# EAGLE design charlie_spire_2 (EAGLE 9.4.0)
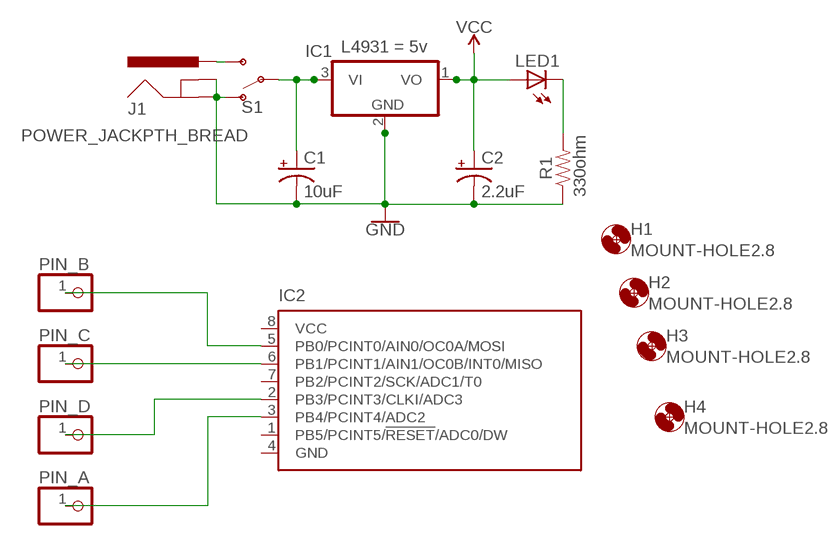
[diagram p0: schematic, sheet 1]

## Parts
C1  10uF  10UF-POLAR-RADIAL-2.5MM-25V-20%  [CPOL-RADIAL-2.5MM-5MM]
C2  2.2uF  10UF-POLAR-RADIAL-2.5MM-25V-20%  [CPOL-RADIAL-2.5MM-5MM]
H1  MOUNT-HOLE2.8  [2,8]
H2  MOUNT-HOLE2.8  [2,8]
H3  MOUNT-HOLE2.8  [2,8]
H4  MOUNT-HOLE2.8  [2,8]
IC1  78L05Z  [TO92]
IC2  TINY13V-10PU  [DIL08]
J1  POWER_JACKPTH_BREAD  [POWER_JACK_PTH_BREAD]
LED1  LED3MM  [LED3MM]
PIN_A  PINHD-1X1  [1X01]
PIN_B  PINHD-1X1  [1X01]
PIN_C  PINHD-1X1  [1X01]
PIN_D  PINHD-1X1  [1X01]
R1  330ohm  RESISTORAXIAL-0.3  [AXIAL-0.3]
S1  SWITCH-SPDT-PTH-11.6X4.0MM  [SWITCH_SPDT_PTH_11.6X4.0MM]

## Nets
GND: C1.2(-) C2.2(-) IC1.2(GND) J1.GND J1.GNDBREAK R1.P$1 S1.1(O)
N$1 [VCC]: J1.PWR S1.3(S)
N$2 [VCC]: C1.1(+) IC1.3(VI) S1.2(P)
N$3: IC2.3(PB4/PCINT4/ADC2) PIN_A.1
N$4: LED1.K(C) R1.P$2
N$5: IC2.5(PB0/PCINT0/AIN0/OC0A/MOSI) PIN_B.1
N$6: IC2.6(PB1/PCINT1/AIN1/OC0B/INT0/MISO) PIN_C.1
N$7: IC2.2(PB3/PCINT3/CLKI/ADC3) PIN_D.1
VCC: C2.1(+) IC1.1(VO) LED1.A
Unconnected: IC2.1(PB5/PCINT5/!RESET!/ADC0/DW) IC2.7(PB2/PCINT2/SCK/ADC1/T0)

## Power pins joined to a net without a drawn wire
GND: IC2.4(GND)
VCC: IC2.8(VCC)

## Library data of the parts
C1 = SparkFun-Capacitors:10UF-POLAR: 10.0µF polarized capacitors A capacitor is a passive two-terminal electrical component used to store electrical energy temporarily in an electric field.; PROD_ID: CAP-08440
C2 = SparkFun-Capacitors:10UF-POLAR: 10.0µF polarized capacitors A capacitor is a passive two-terminal electrical component used to store electrical energy temporarily in an electric field.; PROD_ID: CAP-08440; VALUE: 10uF
H1-H4 = holes:MOUNT-HOLE: MOUNTING HOLE with drill center marker
IC1 = adafruit:78*: Positive VOLTAGE REGULATOR Added bigger pads to the TO-92 package; L4931: 5v
IC2 = atmel:TINY13: 8-bit AVR Microcontroller with 1K Bytes In-System Programmable Flash Source: http://www.atmel.com/dyn/resources/prod_documents/2535S.pdf; MPN: ATTINY45; OC_FARNELL: 9171576; OC_NEWARK: 96K6523
J1 = SparkFun-Connectors:POWER_JACK: Power Jack Connector This is the standard 5.5mm barrel jack for power. The PTH is the most common, proven, reliable, footprint. The Slot footprint only works if the mill layer is transmitted to the PCB fab house so be warned. Here are the connectors we sell at SparkFun: DC Barrel Power Jack/Connector <https://www.sparkfun.com/products/119> (PRT-00119) DC Barrel Power Jack/Connector (SMD) <https://www.sparkfun.com/products/12748> (PRT-12748) DC Barrel Jack Adapter - Breadboard Compatible <https://www.sparkfun.com/products/10811> (PRT-10811) It is used on this SparkFun product (and many, many others): SparkFun RedBoard - Programmed with Arduino <https://www.sparkfun.com/products/12757> (DEV-12757) Also, if you need a mating power supply or connector, please check these out: Wall Adapter Power Supply - 9VDC 650mA <https://www.sparkfun.com/products/298> (TOL-00298) DC Barrel Jack Adapter - Male <https://www.sparkfun.com/products/10287> (PRT-10287); PROD_ID: PRT-10811
LED1 = adafruit:LED: LED OSRAM: - CHIPLED LG R971, LG N971, LY N971, LG Q971, LY Q971, LO R971, LY R971 LH N974, LH R974 LS Q976, LO Q976, LY Q976 LO Q996 - Hyper CHIPLED LW Q18S LB Q993, LB Q99A, LB R99A - SideLED LS A670, LO A670, LY A670, LG A670, LP A670 LB A673, LV A673, LT A673, LW A673 LH A674 LY A675 LS A676, LA A676, LO A676, LY A676, LW A676 LS A679, LY A679, LG A679 - Hyper Micro SIDELED® LS Y876, LA Y876, LO Y876, LY Y876 LT Y87S - SmartLED LW L88C, LW L88S LB L89C, LB L89S, LG L890 LS L89K, LO L89K, LY L89K LS L896, LA L896, LO L896, LY L896 - TOPLED LS T670, LO T670, LY T670, LG T670, LP T670 LSG T670, LSP T670, LSY T670, LOP T670, LYG T670 LG T671, LOG T671, LSG T671 LB T673, LV T673, LT T673, LW T673 LH T674 LS T676, LA T676, LO T676, LY T676, LB T676, LH T676, LSB T676, LW T676 LB T67C, LV T67C, LT T67C, LS T67K, LO T67K, LY T67K, LW E67C LS E67B, LA E67B, LO E67B, LY E67B, LB E67C, LV E67C, LT E67C LW T67C LS T679, LY T679, LG T679 LS T770, LO T770, LY T770, LG T770, LP T770 LB T773, LV T773, LT T773, LW T773 LH T774 LS E675, LA E675, LY E675, LS T675 LS T776, LA T776, LO T776, LY T776, LB T776 LHGB T686 LT T68C, LB T68C - Hyper Mini TOPLED® LB M676 - Mini TOPLED Santana® LG M470 LS M47K, LO M47K, LY M47K Source: http://www.osram.convergy.de/
PIN_A PIN_B PIN_C PIN_D = adafruit:PINHD-1X1: Pin header 1x1 for 0.1" spacing With round pins
R1 = SparkFun-Resistors:RESISTOR: Generic Resistor Package
S1 = SparkFun-Switches:SWITCH-SPDT: Single Pole, Double Throw (SPDT) Switch Single-pole, double-throw (SPDT) switch. Variant Overview SMD-AYZ0202 Surface Mount DPDT Switch <https://www.sparkfun.com/products/597> (COM-00597) Used on e.g. LilyPad Arduino USB - ATmega32U4 Board <https://www.sparkfun.com/products/12049> PTH-11.6X4.0MM SPDT Mini Power Switch <https://www.sparkfun.com/products/102> (COM-00102) Used on e.g. SparkFun Simon Says - Through-Hole Soldering Kit <https://www.sparkfun.com/products/10547> (KIT-10547) PTH-11.6X4.0MM-KIT KIT version of SPDT Mini Power Switch - Simplifies soldering by removing tStop of switch pins - only one side can be soldered. PTH-11.6X4.0MM-LOCK LOCK version of SPDT Mini Power Switch - Offset pins hold switch in place for easier soldering. SMD-RIGHT-ANGLE Surface Mount Right Angle Switch <https://www.sparkfun.com/products/10860> (COM-10860) Used on e.g. SparkFun ESP8266 Thing <https://www.sparkfun.com/products/13231>; PROD_ID: SWCH-08261; SF_SKU: COM-00102

## Net classes
0 default: width 0.254 mm, clearance 0.508 mm
1 VCC: width 0.508 mm, clearance 0.508 mm
2 GND: clearance 0.508 mm

## Board
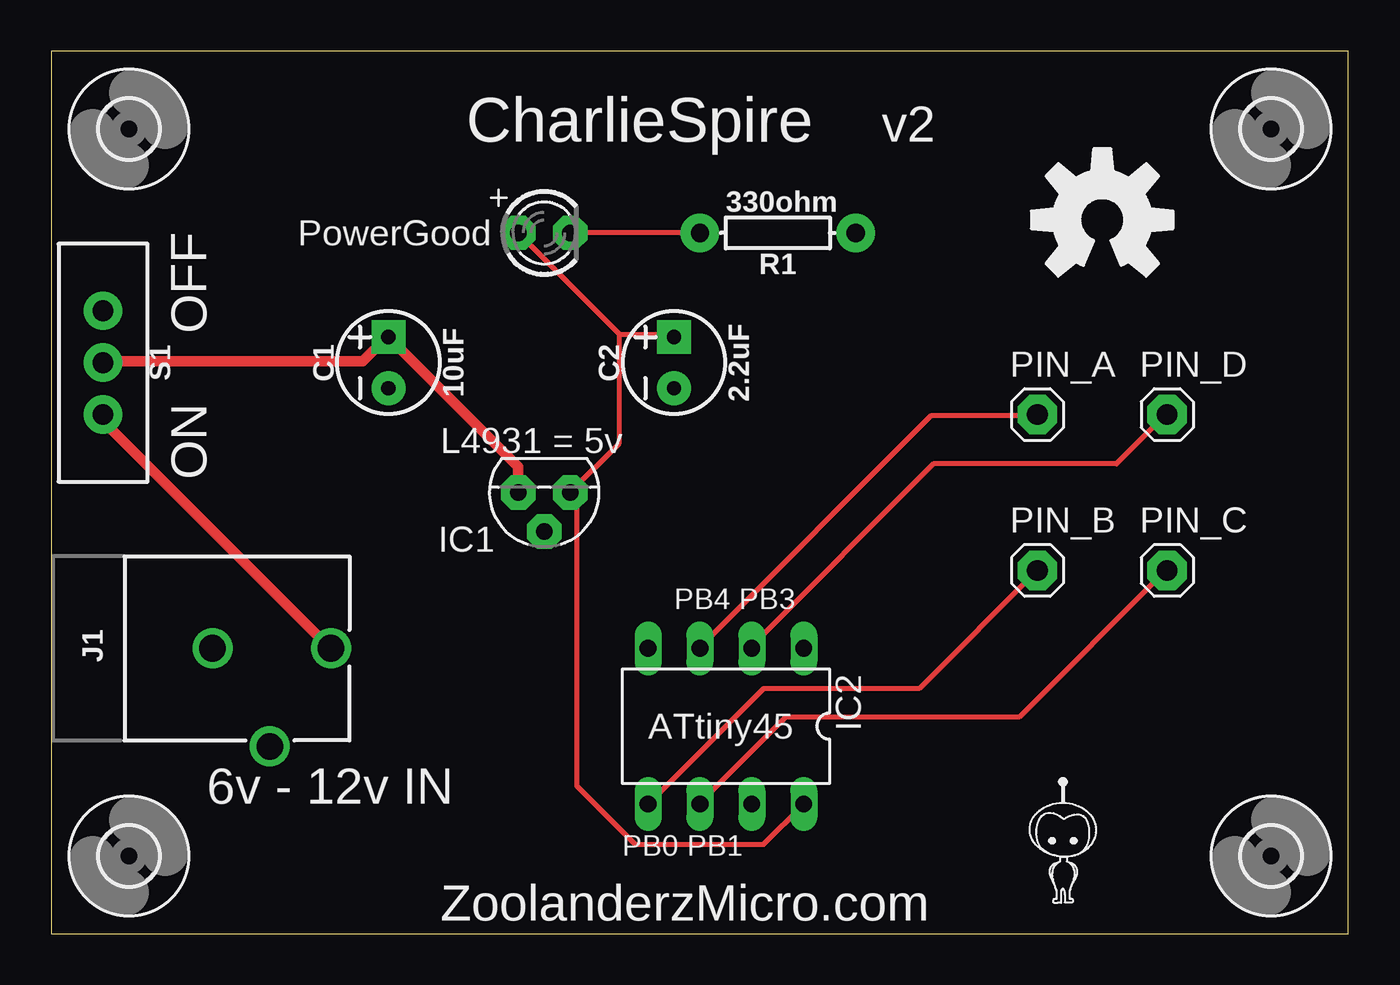
[diagram p1: board, top side]
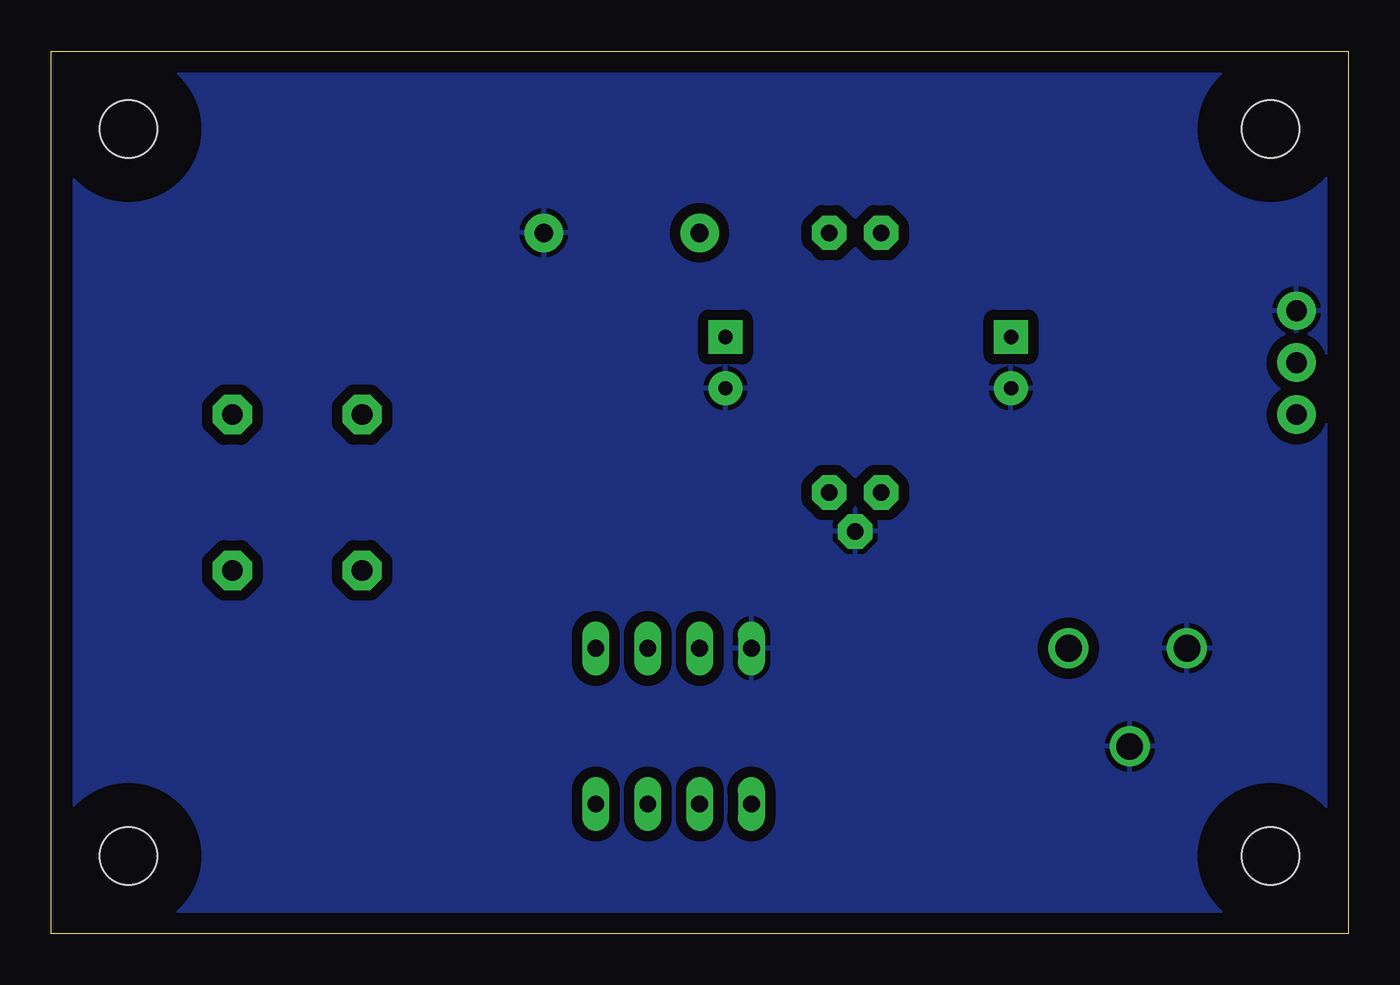
[diagram p2: board, bottom side, seen from below]

Size 63.48 x 43.18 mm. Coordinates in mm from the lower left corner, seen from the top.
Outline: 0,0 63.48,0 63.48,43.18 0,43.18 0,0
Copper layers (1*16): Top 0.035mm / dielectric 1.5mm / Bottom 0.035mm
Design rules "default": minimum track width 6mil, minimum drill 0.35mm, track to track 6mil, track to pad 6mil, pad to pad 6mil, via to via 6mil, smd to smd 6mil, copper to edge 40mil, drill to drill 6mil, minimum pad ring 10mil, minimum via ring 8mil, stop-mask expansion 4mil, vias tented up to drill 0mil, thermal gap 10mil

### Footprints (pad centres in the part's own frame; a part is rotated, then mirrored left to right if it is on the bottom)
CPOL-RADIAL-2.5MM-5MM = drill 0.7 pad 1.651 square: 1 1.25,0 | drill 0.7 pad 1.651: 2 -1.25,0
2,8 = hole 2.8: 0,0
TO92 = drill 0.813 pad 1.676 octagon: 1 -1.27,0; 2 0,1.905; 3 1.27,0
DIL08 = drill 0.813 long: 1 -3.81,-3.81; 2 -1.27,-3.81; 3 1.27,-3.81; 4 3.81,-3.81; 5 3.81,3.81; 6 1.27,3.81; 7 -1.27,3.81; 8 -3.81,3.81
POWER_JACK_PTH_BREAD = drill 1.3: GND 0,7.9; GNDBREAK 4.8,10.7; PWR 0,13.7
LED3MM = drill 0.813 pad 1.676 octagon: A -1.27,0; K 1.27,0
1X01 = drill 1.016 pad 1.93 octagon: 1 0,0
AXIAL-0.3 = drill 0.9 pad 1.88: P$1 -3.81,0; P$2 3.81,0
SWITCH_SPDT_PTH_11.6X4.0MM = drill 1.016 pad 1.88: 1 0,2.54; 2 0,0; 3 0,-2.54

### Placement (x,y rotation side)
C1  16.51,27.94 90 top
C2  30.48,27.94 90 top
H1  3.81,39.37 0 top
H2  3.81,3.81 0 top
H3  59.69,39.37 0 top
H4  59.69,3.81 0 top
IC1  24.13,21.59 180 top
IC2  33.02,10.16 180 top
J1  0,13.97 270 top
LED1  24.13,34.29 0 top
PIN_A  48.26,25.4 0 top
PIN_B  48.26,17.78 0 top
PIN_C  54.61,17.78 0 top
PIN_D  54.61,25.4 0 top
R1  35.56,34.29 180 top
S1  2.54,27.94 0 top
U$1  [OSHW-LOGO-L]  51.44,34.92 0 top
U$2  [QTECHKNOW-LOGO-SMALL-SILK]  49.53,3.81 0 top

### Tracks (layer width: path | path; a pad name or v marks a point on that pad's centre or on a via)
GND
  pour Bottom: 0.64,41.91 1.27,42.55 62.23,42.55 62.87,41.91 62.87,1.27 62.23,0.64 1.27,0.64 0.64,1.27
N$1
  Top 0.508: S1.3 2.67,25.34 2.67,24.96 13.53,14.1 J1.PWR
N$2
  Top 0.508: IC1.3 22.86,22.86 16.57,29.15 C1.1 16.38,29.15 15.24,28 2.67,28 S1.2
N$3
  Top 0.254: IC2.3 31.81,14.1 43.05,25.34 48.2,25.34 PIN_A.1
N$4
  Top 0.254: R1.P$2 LED1.K
N$5
  Top 0.254: IC2.5 34.86,12 42.48,12 PIN_B.1
N$6
  Top 0.254: IC2.6 31.81,6.48 35.94,10.6 47.37,10.6 54.48,17.72 PIN_C.1
N$7
  Top 0.254: IC2.2 34.29,14.1 43.18,22.99 52.13,22.99 54.48,25.34 PIN_D.1
VCC
  Top 0.254: 27.81,29.34 30.48,29.34 C2.1 | LED1.A 27.81,29.34 | IC2.8 34.86,4.38 28.57,4.38 25.72,7.24 25.72,21.34 25.53,21.53 IC1.1 27.81,24 27.81,29.34

### Text on the board
tPlace: CharlieSpire | v2 | PowerGood | L4931 = 5v | ON OFF | PB4 | PB3 | ATtiny45 | 6v - 12v IN | PB0 | PB1 | ZoolanderzMicro.com